# EAGLE design antipaparazzi (EAGLE 7.1.0)
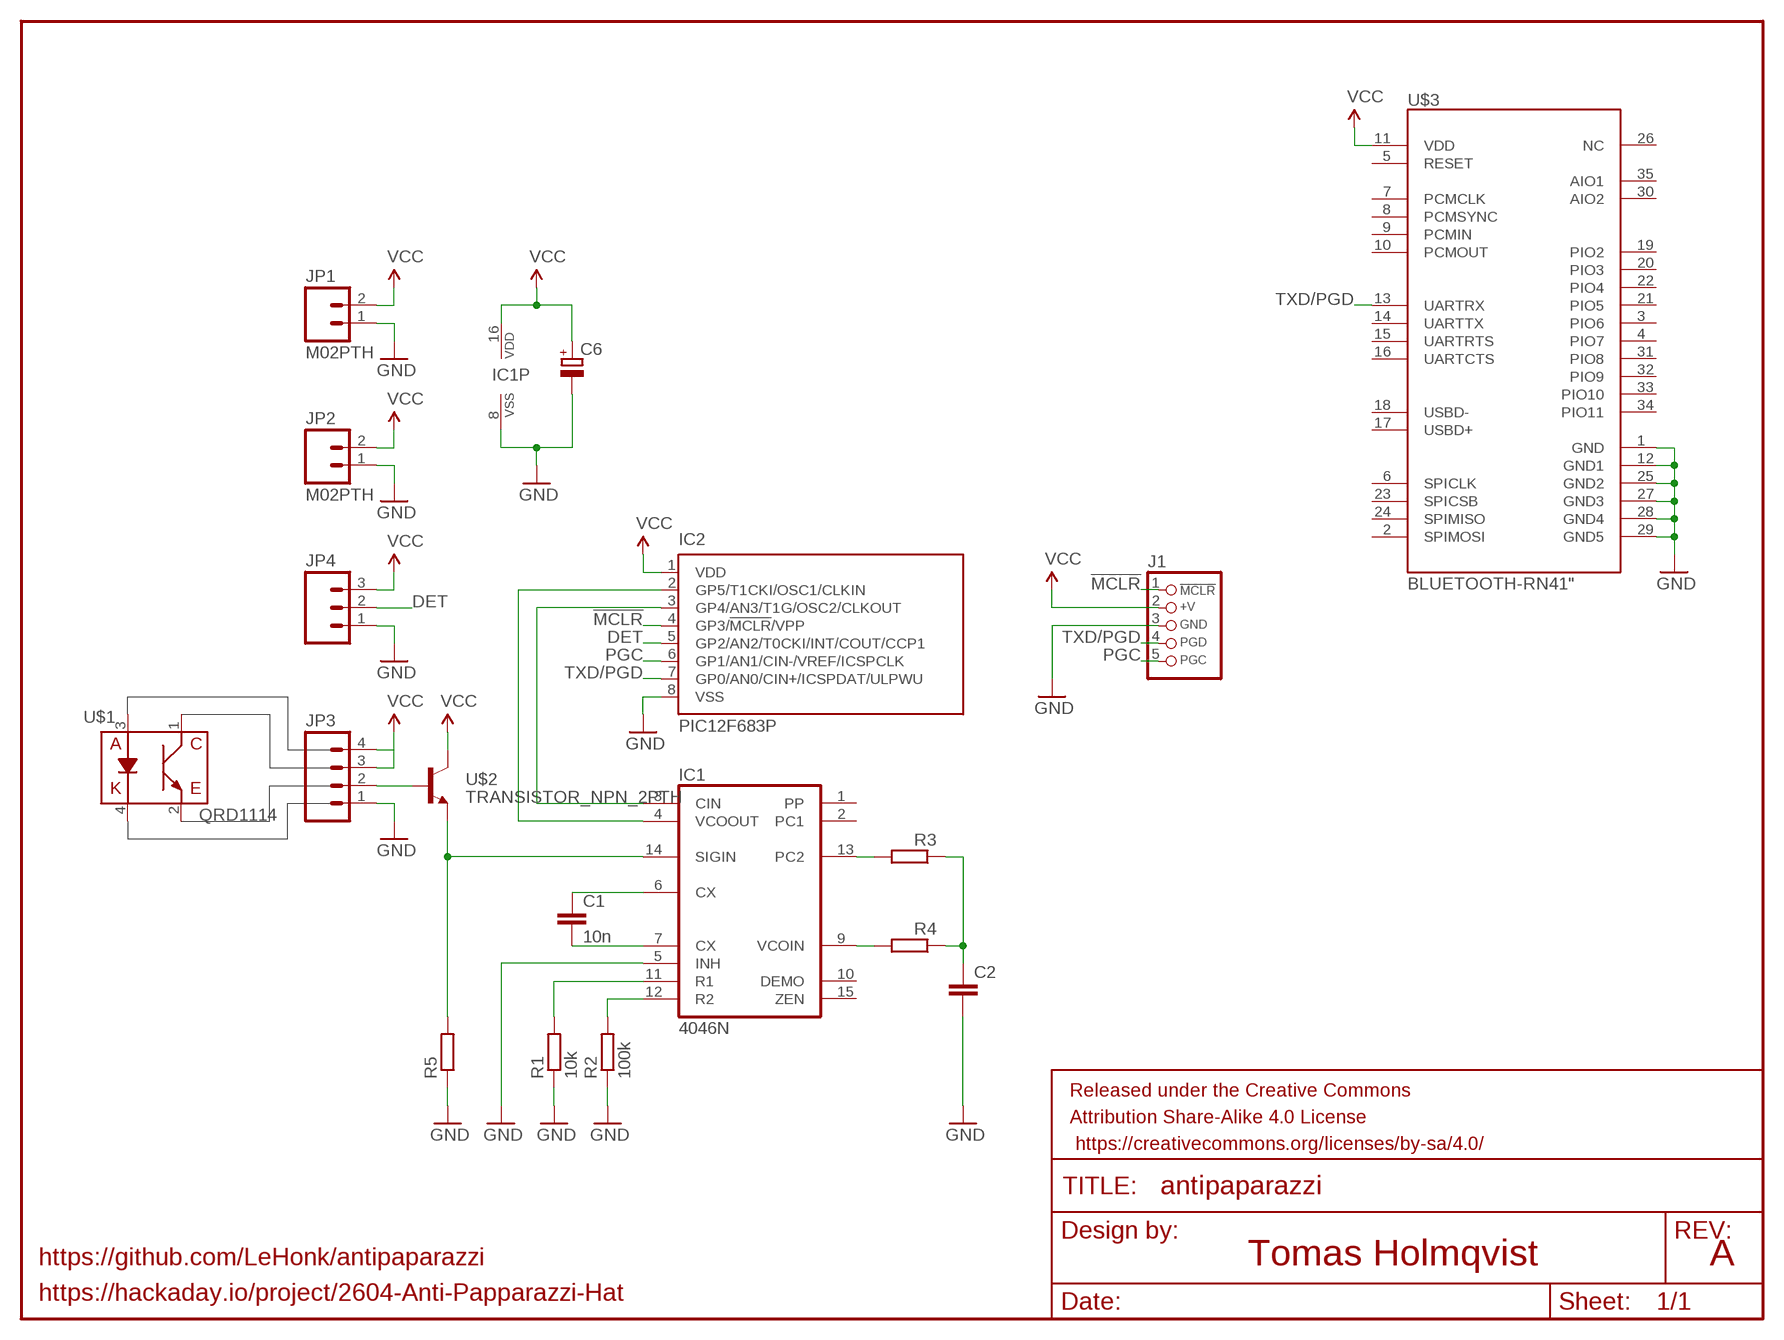
[diagram p0: schematic, sheet 1]

## Parts
C1  10n  C-EU025_050-025X075  [C025_050-025X075]
C2  C-EU025_050-025X075  [C025_050-025X075]
C6  CPOL-EUE2.5-6  [E2,5-6]
FRAME1  FRAME-LETTER  [CREATIVE_COMMONS]
IC1  4046N  [DIL16]
IC2  PIC12F683P  [DIL8]
J1  CON_HEADER_PRG_PIC_ICSP0.1INCH_B  [HEADER_PRG_1X05_ICSP_B]
JP1  M02PTH  [1X02]
JP2  M02PTH  [1X02]
JP3  M04PTH  [1X04]
JP4  M03PTH  [1X03]
R1  10k  R-EU_0207/2V  [0207/2V]
R2  100k  R-EU_0207/2V  [0207/2V]
R3  R-EU_0207/2V  [0207/2V]
R4  R-EU_0207/2V  [0207/2V]
R5  R-EU_0207/2V  [0207/2V]
U$1  QRD1114  [QRD1114]
U$2  TRANSISTOR_NPN_2PTH  [TO-92]
U$3  BLUETOOTH-RN41"  [RN41]

## Nets
!MCLR: IC2.4(GP3/!MCLR!/VPP) J1.1(/MCLR)
DET: IC2.5(GP2/AN2/T0CKI/INT/COUT/CCP1) JP4.2
GND: C2.2 C6.- IC1.5(INH) IC1.8(VSS) IC2.8(VSS) J1.3(GND) JP1.1 JP2.1 JP3.1 JP4.1 R1.1 R2.1 R5.1 U$3.1(GND) U$3.12(GND1) U$3.25(GND2) U$3.27(GND3) U$3.28(GND4) U$3.29(GND5)
N$1: IC1.4(VCOOUT) IC2.2(GP5/T1CKI/OSC1/CLKIN)
N$2: IC1.3(CIN) IC2.3(GP4/AN3/T1G/OSC2/CLKOUT)
N$3: C1.1 IC1.6(CX)
N$4: C1.2 IC1.7(CX)
N$5: IC1.12(R2) R2.2
N$6: IC1.11(R1) R1.2
N$7: IC1.14(SIGIN) R5.2 U$2.3(E)
N$8: C2.1 R3.1 R4.1
N$9: IC1.13(PC2) R3.2
N$10: IC1.9(VCOIN) R4.2
N$11: JP3.2 U$2.2(B)
PGC: IC2.6(GP1/AN1/CIN-/VREF/ICSPCLK) J1.5(PGC)
TXD/PGD: IC2.7(GP0/AN0/CIN+/ICSPDAT/ULPWU) J1.4(PGD) U$3.13(UARTRX)
VCC: C6.+ IC1.16(VDD) IC2.1(VDD) J1.2(+V) JP1.2 JP2.2 JP3.3 JP3.4 JP4.3 U$2.1(C) U$3.11(VDD)
Unconnected: IC1.1(PP) IC1.2(PC1) IC1.10(DEMO) IC1.15(ZEN) U$1.1(E) U$1.2(C) U$1.3(A) U$1.4(K) U$3.2(SPIMOSI) U$3.3(PIO6) U$3.4(PIO7) U$3.5(RESET) U$3.6(SPICLK) U$3.7(PCMCLK) U$3.8(PCMSYNC) U$3.9(PCMIN) U$3.10(PCMOUT) U$3.14(UARTTX) U$3.15(UARTRTS) U$3.16(UARTCTS) U$3.17(USBD+) U$3.18(USBD-) U$3.19(PIO2) U$3.20(PIO3) U$3.21(PIO5) U$3.22(PIO4) U$3.23(SPICSB) U$3.24(SPIMISO) U$3.26(NC) U$3.30(AIO2) U$3.31(PIO8) U$3.32(PIO9) U$3.33(PIO10) U$3.34(PIO11) U$3.35(AIO1)

## Notes on the sheet
- https://github.com/LeHonk/antipaparazzi | Tomas Holmqvist | A
- https://hackaday.io/project/2604-Anti-Papparazzi-Hat

## Library data of the parts
C1 C2 = rcl:C-EU: CAPACITOR, European symbol
C6 = rcl:CPOL-EU: POLARIZED CAPACITOR, European symbol
FRAME1 = SparkFun-Aesthetics:FRAME-LETTER: Schematic Frame Standard 8.5x11 US Letter frame
IC1 = 40xx:4046: Micropower PLL
IC2 = microchip:PIC12F683: 8-Pin Flash-Based, 8-Bit CMOS Microcontrollers with nanoWatt Technology Source: http://ww1.microchip.com/downloads/en/DeviceDoc/41211D_.pdf; MF: MICROCHIP; MPN: PIC12F683-I/P; OC_FARNELL: 9759034; OC_NEWARK: 89H0442
J1 = dp_devices:CON_HEADER_PRG_PIC_ICSP: 5-pin PIC In Circuit Serial Programming header
JP1 JP2 = SparkFun-Connectors:M02: Standard 2-pin 0.1" header. Use with - straight break away headers ( PRT-00116) - right angle break away headers (PRT-00553) - swiss pins (PRT-00743) - machine pins (PRT-00117) - female headers (PRT-00115) Molex polarized connector foot print use with: PRT-08233 with associated crimp pins and housings. 2.54_SCREWTERM for use with PRT-10571. 3.5mm Screw Terminal footprints for PRT-08084 5mm Screw Terminal footprints for use with PRT-08432
JP3 = SparkFun-Connectors:M04: Header 4 Standard 4-pin 0.1" header. Use with straight break away headers (SKU : PRT-00116), right angle break away headers (PRT-00553), swiss pins (PRT-00743), machine pins (PRT-00117), and female headers (PRT-00115). Molex polarized connector foot print use with SKU : PRT-08231 with associated crimp pins and housings. 1MM SMD Version SKU: PRT-10208
JP4 = SparkFun-Connectors:M03: Header 3 Standard 3-pin 0.1" header. Use with straight break away headers (SKU : PRT-00116), right angle break away headers (PRT-00553), swiss pins (PRT-00743), machine pins (PRT-00117), and female headers (PRT-00115). Molex polarized connector foot print use with SKU : PRT-08232 with associated crimp pins and housings.
R1-R5 = rcl:R-EU_: RESISTOR, European symbol
U$1 = SparkFun-Sensors:QRD1114: Reflective object sensor
U$2 = SparkFun-DiscreteSemi:TRANSISTOR_NPN_2: Alternate TO-92 NPN BJT
U$3 = SparkFun-RF:BLUETOOTH-RN41: Bluetooth SMD module

## Board
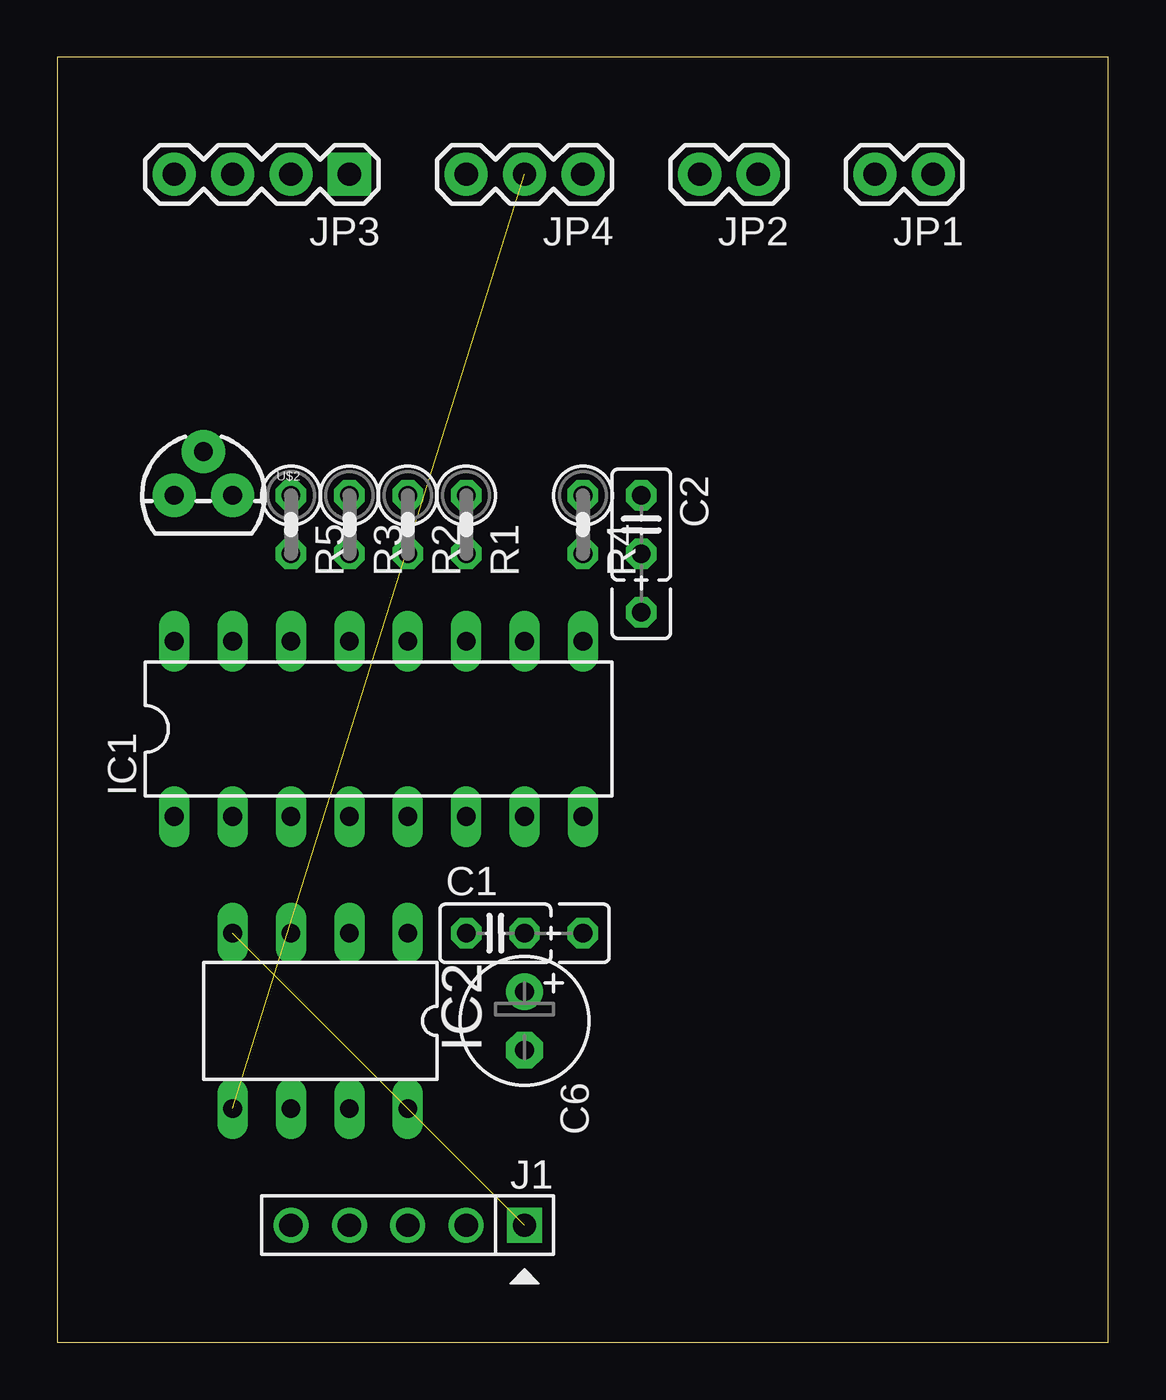
[diagram p1: board, top side]
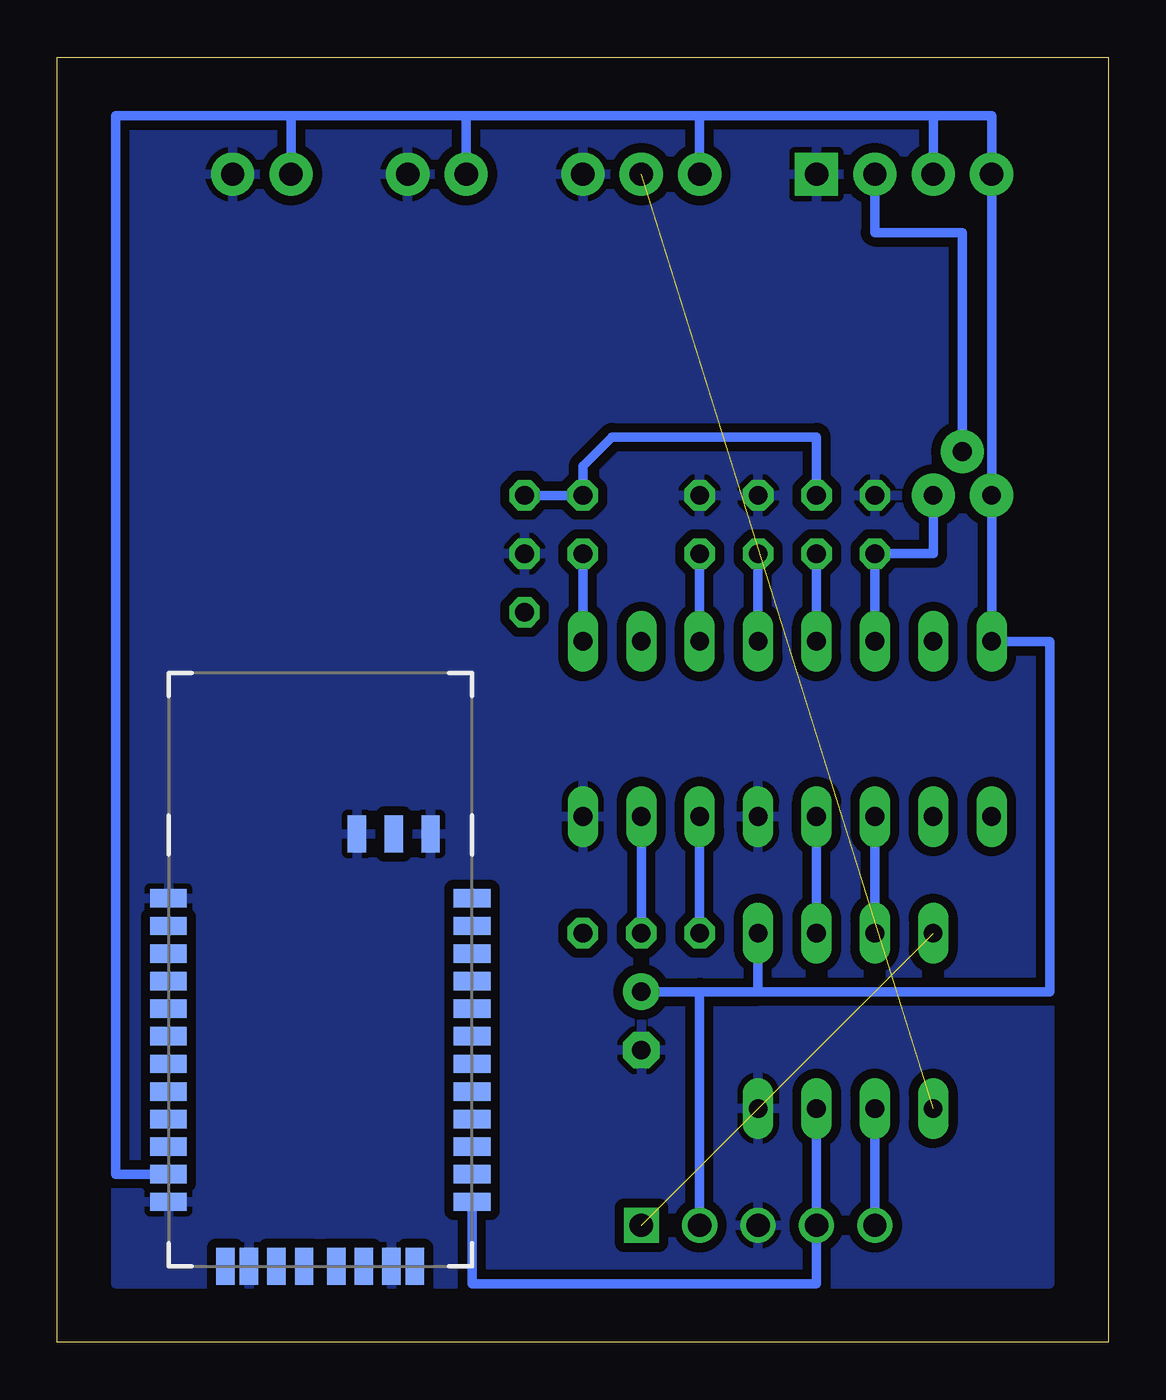
[diagram p2: board, bottom side, seen from below]

Size 45.72 x 55.88 mm. Coordinates in mm from the lower left corner, seen from the top.
Outline: 0,0 45.72,0 45.72,55.88 0,55.88 0,0
Copper layers (1*16): Top 0.035mm / dielectric 1.5mm / Bottom 0.035mm
Design rules "default": minimum track width 10mil, minimum drill 24mil, track to track 8mil, track to pad 8mil, pad to pad 8mil, via to via 8mil, smd to smd 8mil, copper to edge 40mil, drill to drill 8mil, minimum pad ring 10mil, minimum via ring 8mil, stop-mask expansion 4mil, vias tented up to drill 0mil, thermal gap 10mil

### Footprints (pad centres in the part's own frame; a part is rotated, then mirrored left to right if it is on the bottom)
C025_050-025X075 = drill 0.813 octagon: 1 -1.27,0; 2 1.27,0; 3 3.81,0
E2,5-6 = drill 0.813 pad 1.6: + -1.27,0 | drill 0.813 pad 1.6 octagon: - 1.27,0
DIL16 = drill 0.813 long: 1 -8.89,-3.81; 2 -6.35,-3.81; 3 -3.81,-3.81; 4 -1.27,-3.81; 5 1.27,-3.81; 6 3.81,-3.81; 7 6.35,-3.81; 8 8.89,-3.81; 9 8.89,3.81; 10 6.35,3.81; 11 3.81,3.81; 12 1.27,3.81; 13 -1.27,3.81; 14 -3.81,3.81; 15 -6.35,3.81; 16 -8.89,3.81
DIL8 = drill 0.813 long: 1 -3.81,-3.81; 2 -1.27,-3.81; 3 1.27,-3.81; 4 3.81,-3.81; 5 3.81,3.81; 6 1.27,3.81; 7 -1.27,3.81; 8 -3.81,3.81
HEADER_PRG_1X05_ICSP_B = drill 1.016 square: 1 -5.08,0 | drill 1.016: 2 -2.54,0; 3 0,0; 4 2.54,0; 5 5.08,0
1X02 = drill 1.016 pad 1.88: 1 0,0; 2 2.54,0
1X04 = drill 1.016 pad 1.88 square: 1 0,0 | drill 1.016 pad 1.88: 2 2.54,0; 3 5.08,0; 4 7.62,0
1X03 = drill 1.016 pad 1.88: 1 0,0; 2 2.54,0; 3 5.08,0
0207/2V = drill 0.813 octagon: 1 -1.27,0; 2 1.27,0
QRD1114 = drill 0.9: 1 -1.067,1.27; 2 -1.067,-1.27; 3 1.041,-1.27; 4 1.041,1.27
TO-92 = drill 0.813 pad 1.88: 1 -1.27,0; 2 0,1.905; 3 1.27,0
RN41 = smd 0.8 x 1.6: 1 -6.6,-6.6; 2 -5.4,-6.6; 3 -4.2,-6.6; 4 -3,-6.6; 5 -1.8,-6.6; 6 -0.6,-6.6; 7 0.6,-6.6; 8 1.8,-6.6; 9 3,-6.6; 10 4.2,-6.6; 11 5.4,-6.6; 12 6.6,-6.6; 13 6.6,6.6; 14 5.4,6.6; 15 4.2,6.6; 16 3,6.6; 17 1.8,6.6; 18 0.6,6.6; 19 -0.6,6.6; 20 -1.8,6.6; 21 -3,6.6; 22 -4.2,6.6; 23 -5.4,6.6; 24 -6.6,6.6 | smd 1.6 x 0.8: 25 -9.4,4.8; 26 -9.4,3.2; 27 -9.4,1.6; 28 9.4,3.1; 29 9.4,-3.1; 30 9.4,-4.122; 31 9.4,-1.9; 32 9.4,-0.7; 33 9.4,0.7; 34 9.4,1.9; 35 9.4,4.122

### Placement (x,y rotation side)
C1  19.05,17.78 0 top
C2  25.4,35.56 270 top
C6  20.32,13.97 270 top
FRAME1  -11.43,-7.62 0 top  (outside the outline)
IC1  13.97,26.67 0 top
IC2  11.43,13.97 180 top
J1  15.24,5.08 180 top
JP1  38.1,50.8 180 top
JP2  30.48,50.8 180 top
JP3  12.7,50.8 180 top
JP4  22.86,50.8 180 top
R1  17.78,35.56 270 top
R2  15.24,35.56 270 top
R3  12.7,35.56 270 top
R4  22.86,35.56 270 top
R5  10.16,35.56 270 top
U$1  8.89,62.23 0 top  (outside the outline)
U$2  6.35,36.83 0 top
U$3  34.29,12.7 270 bottom

### Tracks (layer width: path | path; a pad name or v marks a point on that pad's centre or on a via)
!MCLR  (1 unrouted)
DET  (1 unrouted)
GND
  pour Bottom (isolate 0.406): 2.54,2.54 43.18,2.54 43.18,53.34 2.54,53.34
N$1
  Bottom 0.406: IC2.2 IC1.4
N$2
  Bottom 0.406: IC2.3 IC1.3
N$3
  Bottom 0.406: C1.1 IC1.6
N$4
  Bottom 0.406: C1.2 IC1.7
N$5
  Bottom 0.406: IC1.12 R2.2
N$6
  Bottom 0.406: IC1.11 R1.2
N$7
  Bottom 0.406: IC1.14 R5.2 7.62,34.29 U$2.3
N$8
  Bottom 0.406: R3.1 12.7,39.37 21.59,39.37 22.86,38.1 R4.1 C2.1
N$9
  Bottom 0.406: IC1.13 R3.2
N$10
  Bottom 0.406: IC1.9 R4.2
N$11
  Bottom 0.406: JP3.2 10.16,48.26 6.35,48.26 U$2.2
PGC
  Bottom 0.406: J1.5 IC2.6
TXD/PGD
  Bottom 0.406: IC2.7 J1.4 12.7,2.54 27.69,2.54 U$3.13
VCC
  Bottom 0.406: 7.62,53.34 5.08,53.34 JP3.4 U$2.1 IC1.16 2.54,30.48 2.54,15.24 15.24,15.24 | 7.62,53.34 JP3.3 7.62,53.34 | 7.62,53.34 17.78,53.34 | 17.78,53.34 JP4.3 17.78,53.34 | 17.78,53.34 27.94,53.34 | 27.94,53.34 JP2.2 27.94,53.34 | 27.94,53.34 35.56,53.34 | 35.56,53.34 JP1.2 | C6.+ 17.78,15.24 | 17.78,15.24 15.24,15.24 | 15.24,15.24 IC2.1 | U$3.11 43.18,7.3 43.18,53.34 35.56,53.34 | J1.2 17.78,15.24